# Altium schematic sheet Booster_USER_IFC.SchDoc: 8 channel PA
size 420 x 297 mm; Author: G.K.; CompanyName: WUT; DrawnBy: G.K.; Organization: WUT ISE; Address1: Warsaw Univeristy of Technology; Address2: Nowowiejska 15/19; DocumentNumber: 1; Revision: -; SheetNumber: 1; SheetTotal: 3; EDA_Number: ARTIQ; Projet: Booster RF Power Amplifier; ModifiedBy: -; CreateDate: XX/XX/XXXX; CheckedDate: -; Title2: TOP; DivGrp: ISE; Designer: G.K.; ModifiedDate: -; ProjectName: Booster RF Power Amplifier
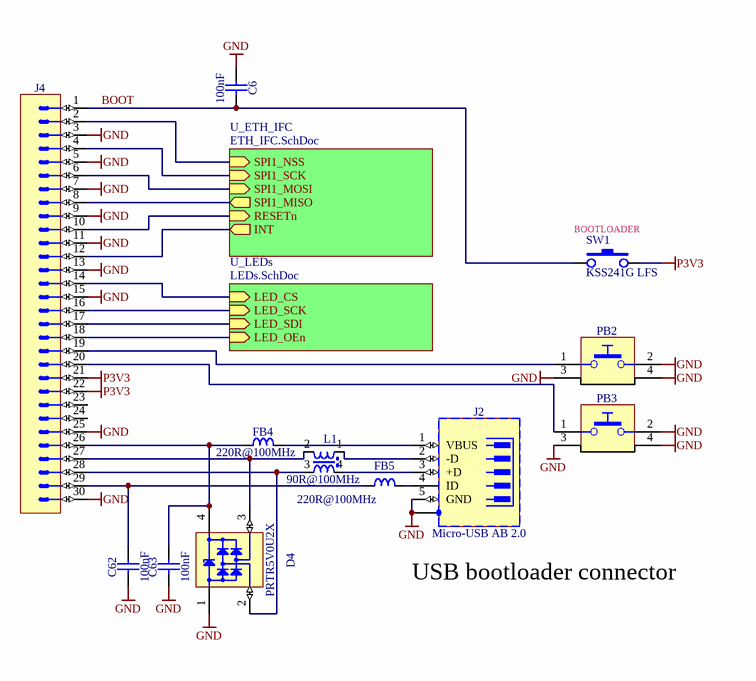
[diagram p0: Booster_USER_IFC.SchDoc]

## Parts
C6  100nF  [CAPC1005X55N]
C62  100nF  [CAPC1005X55N]
C63  100nF  [CAPC1005X55N]
D4  PRTR5V0U2X  [SOT190P230X110-4N]
FB4  220R@100MHz  [INDC2012X105N]
FB5  220R@100MHz  [INDC2012X105N]
J2  Micro-USB AB 2.0  [HIROSE_ZX62RD-AB-5P8]
J4  (no value)  [3M_N2530-6002RB]
L1  90R@100MHz  [IND_MURATA_DLW21S]
PB2  Push Button  [PB_TYCO_1-1825027-1]  (value not drawn)
PB3  Push Button  [PB_TYCO_1-1825027-1]  (value not drawn)
SW1  KSS241G LFS  [KSS241G LFS]

## Sub-sheets
U_ETH_IFC = ETH_IFC.SchDoc: SPI1_NSS (in), SPI1_SCK (in), SPI1_MOSI (in), SPI1_MISO (out), INT (out), RESETn (in)
U_LEDs = LEDs.SchDoc: LED_CS (in), LED_SCK (in), LED_SDI (in), LED_OEn (in)

## Nets
GND: C6.1 C62.1 C63.1 D4.1(GND) J2.5(GND) J2.6(SH) J4.3 J4.5 J4.7 J4.9 J4.11 J4.13 J4.15 J4.25 J4.30 PB2.2 PB2.3 PB2.4 PB3.2 PB3.3 PB3.4
P3V3: J4.21 J4.22 SW1.2
BOOT: C6.2 J4.1 SW1.1
NetC62_2: C62.2 FB5.1 J4.29
NetC63_2: C63.2 D4.4(VCC) FB4.1 J4.26
NetD4_2: D4.2(I/O1) J4.28 L1.3
NetD4_3: D4.3(I/O2) J4.27 L1.2
NetFB4_2: FB4.2 J2.1(VBUS)
NetFB5_2: FB5.2 J2.4(ID)
NetJ2_2: J2.2(-D) L1.1
NetJ2_3: J2.3(+D) L1.4
NetJ4_2: J4.2 ; sheet U_ETH_IFC/SPI1_NSS
NetJ4_4: J4.4 ; sheet U_ETH_IFC/SPI1_SCK
NetJ4_6: J4.6 ; sheet U_ETH_IFC/SPI1_MOSI
NetJ4_8: J4.8 ; sheet U_ETH_IFC/SPI1_MISO
NetJ4_10: J4.10 ; sheet U_ETH_IFC/RESETn
NetJ4_12: J4.12 ; sheet U_ETH_IFC/INT
NetJ4_14: J4.14 ; sheet U_LEDs/LED_CS
NetJ4_16: J4.16 ; sheet U_LEDs/LED_SCK
NetJ4_17: J4.17 ; sheet U_LEDs/LED_SDI
NetJ4_18: J4.18 ; sheet U_LEDs/LED_OEn
NetJ4_19: J4.19 PB2.1
NetJ4_20: J4.20 PB3.1

Not connected (* = marked no-connect by the designer): J4 23 24

## Notes on the sheet
- (near SW1) BOOTLOADER
- (near J2) USB bootloader connector
- Project/Equipment
- Document
- Designer
- Drawn by
- Check.by
- File
- Last Mod.
- Print Date
- Sheet
- Size
- A3
- of
- Rev

## Library data of the parts
C6 C62 C63 = CC0402_100NF_16V_10%_X7R: Non-polarised capacitor; Part Description: SMD Multilayer Chip Ceramic Capacitor; Manufacturer: GENERIC; Manufacturer1 Part Number: GRM155R71C104KA88D; Voltage: 16V; TC: X7R; Tolerance: ±10%; Part Number: CC0402_100NF_16V_10%_X7R; Component Kind: Standard; Component Type: Standard; Pin Count: 2; Value: 100nF; Status: Not Recommended; Manufacturer Part Number: CC0402_100NF_16V_10%_X7R; Case: 0402; Mounted: Yes; Socket: No; SMD: Yes; Manufacturer1 Example: MURATA; Manufacturer1 ComponentHeight: 0.55mm; HelpURL: \\cern.ch\dfs\Applications\Altium\Datasheets\CC0402_X7R_MURATA_GRM.pdf; Author: CERN DEM JLC; CreateDate: 05.12.2013; LatestRevisionDate: 03.12.2007; Sense: No
D4 = PRTR5V0U2X: Ultra Low Capacitance Double Rail-to-Rail ESD Protection Diode; Part Description: Ultra Low Capacitance (1pF) Double Rail-to-Rail ESD Protection Diode (8kV); Manufacturer: NXP SEMICONDUCTORS; Voltage: 5.5V; PressFit: No; Bonding: No; Part Number: PRTR5V0U2X; Component Kind: Standard; Component Type: Standard; Device: PRTR5V0U2X; PackageDescription: SOT143B, SOT, 1.90mm Pitch; 4 Pin, 1.30mm W X 2.90mm L X 1.10mm H body, IPC Medium Density; Manufacturer Part Number: PRTR5V0U2X; Pin Count: 4; Case: SOT143B; Mounted: Yes; Socket: No; SMD: Yes; Sense: No; ComponentHeight: 1.1mm; HelpURL: \\cern.ch\dfs\Applications\Altium\Datasheets\PRTR5V0U2X.pdf; Author: CERN DEM JLC; CreateDate: 22.03.2011; LatestRevisionDate: 22.03.2011
FB4 FB5 = IND0805_MURATA_BLM21PG221SN1D: Inductor; Part Description: SMD EMIFIL Suppression Chip Ferrite Bead; Manufacturer: MURATA; Power: 2A; Resistance: 0.05R; Tolerance: ±25%; Table: Inductors SMD; Part Number: IND0805_MURATA_BLM21PG221SN1D; Component Kind: Standard; Component Type: Standard; Pin Count: 2; Value: 220R@100MHz; Status: None; Manufacturer Part Number: BLM21PG221SN1D; Case: 0805; Mounted: Yes; Socket: No; SMD: Yes; ComponentHeight: 1.05mm; HelpURL: \\cern.ch\dfs\Applications\Altium\Datasheets\IND0402_MURATA_BLM21P.pdf; Author: CERN DEM JLC; CreateDate: 2010-01-25; LatestRevisionDate: 2010-01-25
J2 = HIROSE_ZX62RD-AB-5P8: 5 Pin + 1 Shield USB Receptacle; Part Description: Micro-USB 2.0 Right Angle, SMD Type AB - Reverse (Top mount), Shell Through Hole; Manufacturer: HIROSE (HRS); PressFit: No; Part Number: HIROSE_ZX62RD-AB-5P8; Component Kind: Standard; Component Type: Standard; Pin Count: 7; Family: Micro-USB AB 2.0; Mounted: Yes; Socket: No; SMD: Yes; Sense: No; Status: None; Manufacturer Part Number: ZX62RD-AB-5P8; ComponentHeight: 2.35mm; HelpURL: \\cern.ch\dfs\Applications\Altium\Datasheets\HIROSE_ZX62RD-AB-5P8.pdf; ComponentLink1URL: \\cern.ch\dfs\Applications\Altium\Datasheets\HIROSE_ZX62RD-AB-5P8_Package-Drawing.pdf; ComponentLink1Description: Package-Drawing; Author: CERN DEM JLC; CreateDate: 29.10.2014; LatestRevisionDate: 29.10.2014
J4 = 3M_N2530-6002RB: Connector 30 Male; Part Description: 30 Contacts - Straight .100'' x .100'' Low Profile Four-Wall Header, 2500 Series; Manufacturer: 3M; PressFit: No; Part Number: 3M_N2530-6002RB; Component Kind: Standard; Component Type: Standard; Pin Count: 30; Family: Header 30; Mounted: Yes; Socket: No; SMD: No; Sense: No; Status: None; Manufacturer Part Number: N2530-6002RB; ComponentHeight: 10.03mm; HelpURL: \\cern.ch\dfs\Applications\Altium\Datasheets\3M_N2530-6002RB.pdf; Author: CERN DEM JLC; CreateDate: 11.02.2009; LatestRevisionDate: 11.08.2009
L1 = IND_MURATA_DLW21SN900SQ2L: Inductor Common Mode; Part Description: Wire Wound Common Mode Choke Coil (DLW21S Series); Manufacturer: MURATA; Power: 330mA; Resistance: 0.35R; Tolerance: ±25%; Part Number: IND_MURATA_DLW21SN900SQ2L; Component Kind: Standard; Component Type: Standard; Pin Count: 4; Value: 90R@100MHz; Status: None; Manufacturer Part Number: DLW21SN900SQ2L; Case: 0805; Mounted: Yes; Socket: No; SMD: Yes; Sense: No; ComponentHeight: 1.4mm; HelpURL: \\cern.ch\dfs\Applications\Altium\Datasheets\IND_MURATA_DLW21S.pdf; Author: CERN DEM JLC; CreateDate: 01.07.2014; LatestRevisionDate: 01.07.2014
PB2 PB3 = PB_TYCO_1-1825027-1: Push-Button Switch SPDT; Part Description: Right Angle Micro Miniature Tactile Pushbutton Switch, Round Actuator Length = 5.74mm, FSMRAJ Serie; Manufacturer: TYCO ELECTRONICS; PressFit: No; Part Number: PB_TYCO_1-1825027-1; Component Kind: Standard; Component Type: Standard; Pin Count: 4; PackageDescription: Right Angle Micro Miniature Tactile Pushbutton Switch, Round Actuator Length = 5.74mm, FSMRAJ Serie; Family: Push Button; Mounted: Yes; Socket: No; SMD: No; Sense: No; Status: None; Manufacturer Part Number: 1-1825027-1; ComponentHeight: 7.01mm; HelpURL: \\cern.ch\dfs\Applications\Altium\Datasheets\PB_TYCO_1-1825027-1.pdf; Author: CERN DEM JLC; CreateDate: 17.04.2013; LatestRevisionDate: 28.10.2013
SW1 = SW-TACT_SMD_RA_mini: Push button; Supplier 1: Farnell; Supplier Part Number 1: 1437640